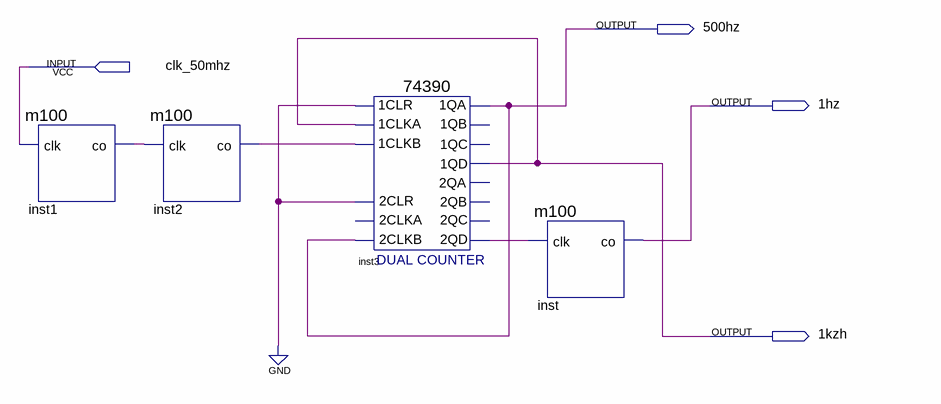
[diagram p0: schematic sheet]
// Quartus schematic fre_div.bdf as structural Verilog: 4 symbols, 4 pins
module fre_div (
  input  clk_50mhz,
  output \500hz ,
  output \1hz ,
  output \1kzh 
);

  wire inst1_co, inst2_co, inst3_2qd;

  m100 inst1 (.clk(clk_50mhz), .co(inst1_co));
  m100 inst2 (.clk(inst1_co), .co(inst2_co));
  \74390  inst3 (
    .\2CLR (1'b0), .\2CLKB (\500hz ), .\1CLR (1'b0), .\1CLKA (\1kzh ), .\1CLKB (inst2_co), .\1QA (\500hz ),
    .\1QD (\1kzh ), .\2QD (inst3_2qd));  // open: 2CLKA, 1QB, 1QC, 2QA, 2QB, 2QC
  m100 inst (.clk(inst3_2qd), .co(\1hz ));
endmodule
